# EAGLE design untitled2 (EAGLE 7.2.0)
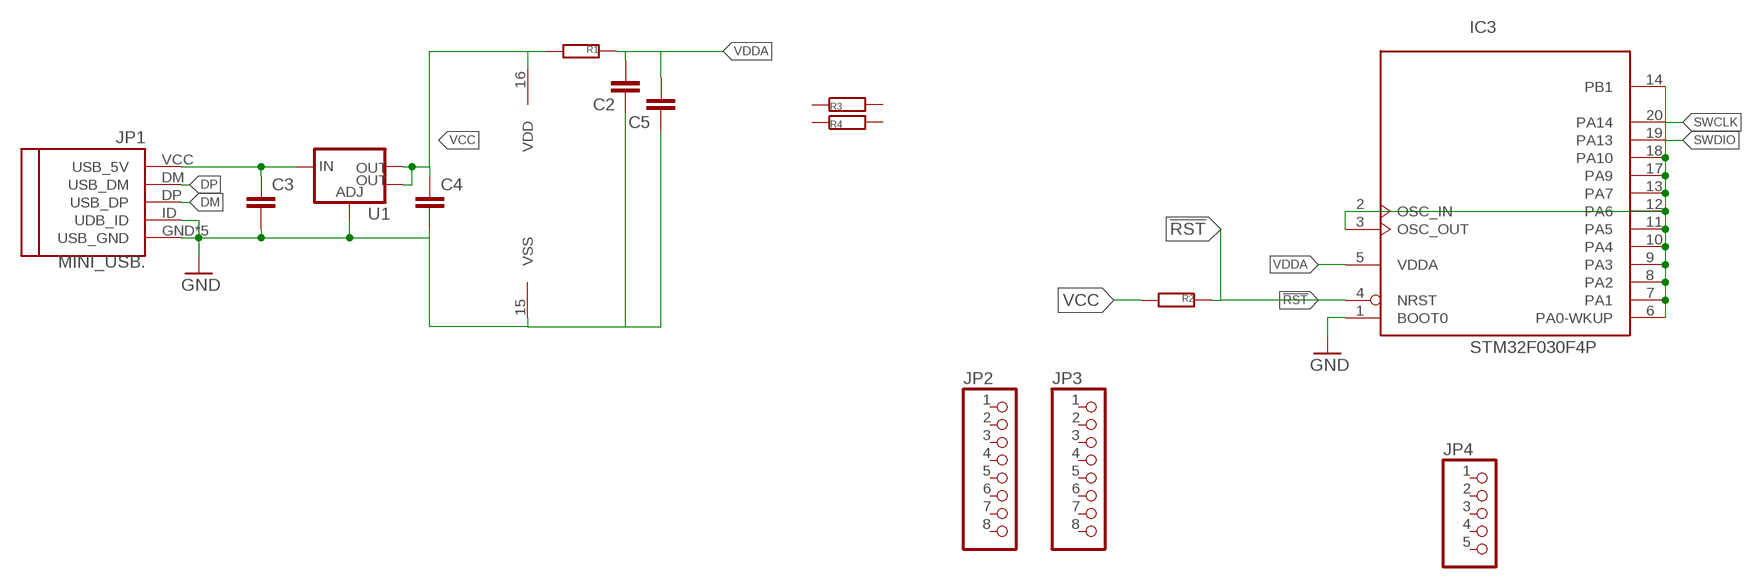
[diagram p0: schematic, sheet 1]

## Parts
C2  CC0805  [C0805]
C3  CC0805  [C0805]
C4  CC0805  [C0805]
C5  CC0805  [C0805]
IC3  STM32F030F4P  [TSSOP20-I]
JP1  MINI_USB.  [32005-201]
JP2  PINHD-1X08_2.54  [1X08]
JP3  PINHD-1X08_2.54  [1X08]
JP4  PINHD-1X05_2.54  [1X05]
R1  R0603  [0603]
R2  R0603  [0603]
R3  R0805  [R0805]
R4  R0805  [R0805]
U1  V_REG_LM1117SOT223  [SOT223]

## Nets
5V: C3.1 JP1.VCC(USB_5V) U1.3(IN)
!RST: IC3.4(NRST) R2.1
DM: JP1.DP(USB_DP)
DP: JP1.DM(USB_DM)
GND: C2.1 C3.2 C4.2 C5.1 IC3.1(BOOT0) IC3.15(VSS) JP1.GND(USB_GND) JP1.ID(UDB_ID) JP1.M1(USB_GND) JP1.M2(USB_GND) JP1.M3(USB_GND) JP1.M4(USB_GND) U1.1(ADJ)
N$4: IC3.2(OSC_IN) IC3.3(OSC_OUT) IC3.6(PA0-WKUP) IC3.7(PA1) IC3.8(PA2) IC3.9(PA3) IC3.10(PA4) IC3.11(PA5) IC3.12(PA6) IC3.13(PA7) IC3.14(PB1) IC3.17(PA9) IC3.18(PA10)
SWCLK: IC3.20(PA14)
SWDIO: IC3.19(PA13)
VCC: C4.1 IC3.16(VDD) R1.2 R2.2 U1.2(OUT) U1.4(OUT)
VDDA: C2.2 C5.2 IC3.5(VDDA) R1.1
Unconnected: JP2.1 JP2.2 JP2.3 JP2.4 JP2.5 JP2.6 JP2.7 JP2.8 JP3.1 JP3.2 JP3.3 JP3.4 JP3.5 JP3.6 JP3.7 JP3.8 JP4.1 JP4.2 JP4.3 JP4.4 JP4.5 R3.1 R3.2 R4.1 R4.2

## Library data of the parts
C2-C5 = CasaLibrary:C: Capacitor
IC3 = micro-stm_v3:STM32F030F*P: ARM 32-bit Cortex™-M0 CPU 48 MHz maximum frequency 16 Kbytes of Flash memory 4 kbytes of SRAM 15 GPIOs 2.4 to 3.6 V application supply
JP1 = connectors:MINI_USB
JP2 JP3 = pinhead-2:PINHD-1X08: PIN HEADER
JP4 = pinhead-2:PINHD-1X05: PIN HEADER
R1-R4 = CasaLibrary:R
U1 = CasaLibrary:V_REG_LM1117: Voltage Regulator LM1117 Standard adjustable voltage regulator but in SMD form. Spark Fun Electronics SKU : COM-00595; PROD_ID: VREG-08170

## Board
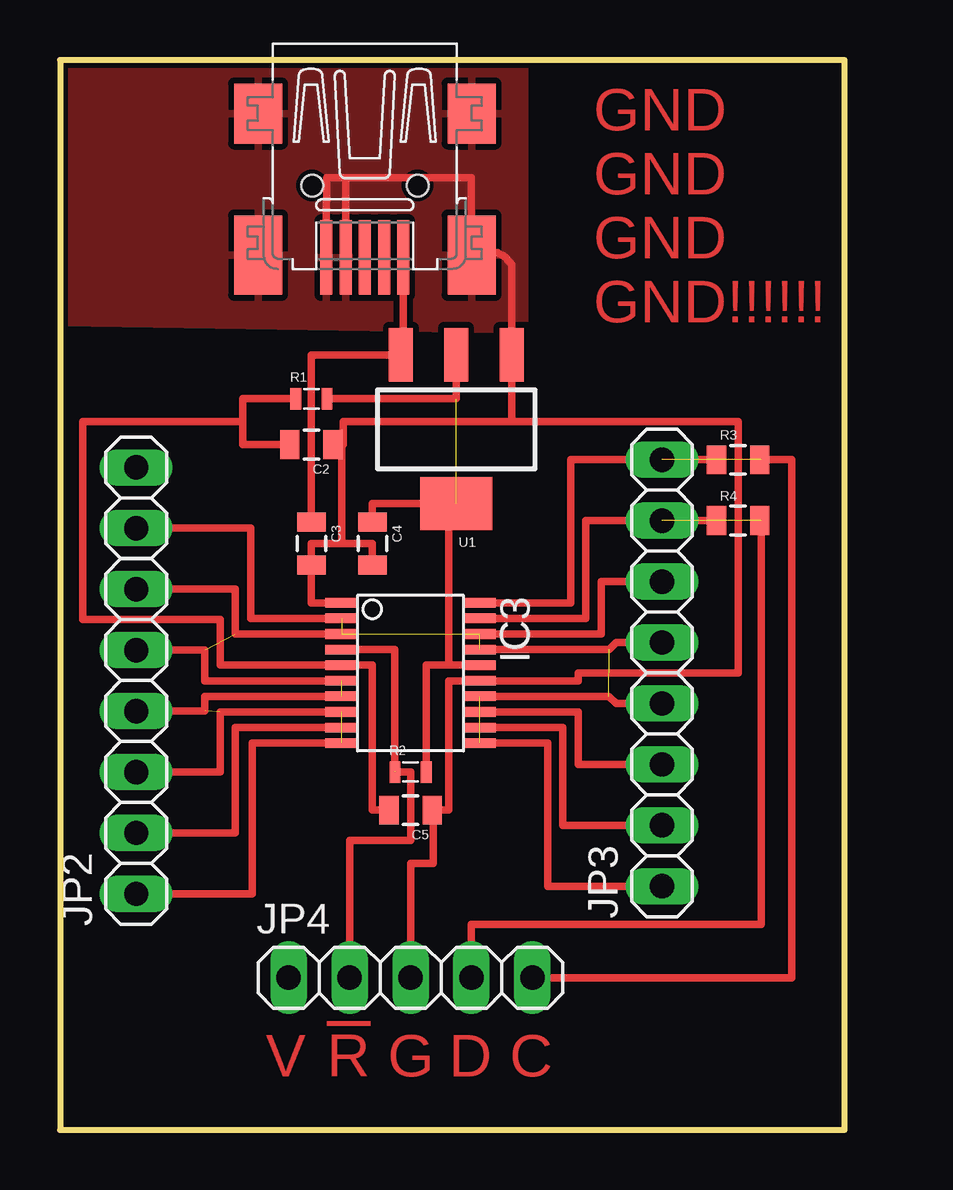
[diagram p1: board, top side]

Size 32.7 x 44.6 mm. Coordinates in mm from the lower left corner, seen from the top.
Outline: 0,0 32.7,0 32.7,44.6 0,44.6 0,0
Copper layers (1*16): Top 0.035mm / dielectric 1.5mm / Bottom 0.035mm
Design rules "default *": minimum track width 0.2mm, minimum drill 0.2mm, track to track 0.25mm, track to pad 0.25mm, pad to pad 0.25mm, via to via 0.25mm, smd to smd 0.2mm, copper to edge 0.2mm, drill to drill 0.2mm, minimum pad ring 10mil, minimum via ring 8mil, stop-mask expansion 4mil, vias tented up to drill 0mil, thermal gap 10mil

### Footprints (pad centres in the part's own frame; a part is rotated, then mirrored left to right if it is on the bottom)
C0805 = smd 0.8 x 1.2: 1 -0.9,0; 2 0.9,0
TSSOP20-I = smd 0.4 x 1.35: 1 -2.925,-2.875; 2 -2.275,-2.875; 3 -1.625,-2.875; 4 -0.975,-2.875; 5 -0.325,-2.875; 6 0.325,-2.875; 7 0.975,-2.875; 8 1.625,-2.875; 9 2.275,-2.875; 10 2.925,-2.875; 11 2.925,2.875; 12 2.275,2.875; 13 1.625,2.875; 14 0.975,2.875; 15 0.325,2.875; 16 -0.325,2.875; 17 -0.975,2.875; 18 -1.625,2.875; 19 -2.275,2.875; 20 -2.925,2.875
32005-201 = smd 3.1 x 0.5: DM 3,0.8; DP 3,0; GND 3,-1.6; ID 3,-0.8; VCC 3,1.6 | smd 2.5 x 2: M1 -3,-4.45; M2 -3,4.45 | smd 3.3 x 2: M3 2.9,4.45; M4 2.9,-4.45 | hole 0.9: 0,2.2; 0,-2.2
1X08 = drill 1.016 long: 1 -8.89,0; 2 -6.35,0; 3 -3.81,0; 4 -1.27,0; 5 1.27,0; 6 3.81,0; 7 6.35,0; 8 8.89,0
1X05 = drill 1.016 long: 1 -5.08,0; 2 -2.54,0; 3 0,0; 4 2.54,0; 5 5.08,0
0603 = smd 0.45 x 0.9: 1 -0.65,0; 2 0.65,0
R0805 = smd 0.8 x 1.2: 1 -0.9,0; 2 0.9,0
SOT223 = smd 1 x 2.235: 1 -2.311,-3.099; 2 0,-3.099; 3 2.311,-3.099 | smd 3 x 2.2: 4 0,3.099

### Placement (x,y rotation side)
C2  10.48,28.58 180 top
C3  10.48,24.45 270 top
C4  13.02,24.45 270 top
C5  14.61,13.34 180 top
IC3  14.61,19.05 270 top
JP1  12.7,39.37 270 top
JP2  3.17,18.73 90 top
JP3  25.08,19.05 90 top
JP4  14.61,6.35 0 top
R1  10.48,30.48 0 top
R2  14.61,14.92 0 top
R3  28.26,27.94 0 top
R4  28.26,25.4 0 top
U1  16.51,29.21 180 top

### Tracks (layer width: path | path; a pad name or v marks a point on that pad's centre or on a via)
5V
  Top 0.305: JP1.VCC 14.3,32.41 U1.3 10.48,32.31 C3.1
!RST  (1 unrouted)
  Top 0.305: IC3.4 13.96,20.02 R2.1 | 13.97,14.92 14.6,14.92 14.6,12.07 12.07,12.07 12.07,6.98
GND
  Top 0.305: 11.75,21.98 IC3.1 10.48,21.98 C3.2 | C5.1 16.19,13.34 16.19,18.73 IC3.15 21.59,18.73 21.59,19.05 28.26,19.05 28.26,29.53 18.82,29.53 | JP1.M3 arc-90 18.82,36.07 U1.1 18.82,29.53 | 18.82,29.53 11.8,29.53 11.8,28.58 11.75,28.58 | JP1.GND 11.1,38.73 11.11,38.73 11.11,39.69 11.9,39.69 | 11.9,39.69 17.14,39.69 17.14,36.51 | JP1.ID 11.9,39.69 | C2.1 11.75,28.58 | 10.48,23.5 C3.2 | 11.75,28.58 11.75,24.45 | 11.75,24.45 10.48,24.45 C3.2 | 11.75,24.45 13.02,24.45 C4.2
  pour Top: 0,44.77 19.37,44.45 19.37,33.34 0,33.66
N$2
  Top 0.305: 15.56,13.02 15.56,11.11 14.6,11.11 14.6,6.98
N$3
  Top 0.305: 27.31,27.94 26.03,27.94
N$4  (12 unrouted)
  Top 0.305: IC3.18 22.54,20.68 22.54,22.86 24.76,22.86 | IC3.17 22.88,20.02 23.18,20.32 25.08,20.32 | IC3.14 22.86,18.07 23.18,17.78 25.08,17.78 | IC3.13 21.59,17.43 21.59,15.24 25.08,15.24 | IC3.12 20.96,16.77 20.96,12.7 25.08,12.7 | IC3.11 20.32,16.12 20.32,10.16 25.08,10.16 | IC3.6 6.03,18.73 6.03,20 3.18,20 | IC3.7 6.03,18.07 6.03,17.46 3.18,17.46 | IC3.8 6.67,17.43 6.67,14.92 3.18,14.92 | IC3.9 7.3,16.77 7.3,12.38 3.18,12.38 | IC3.10 8.01,16.12 8.01,9.84 3.18,9.84 | IC3.3 7.3,20.68 7.3,22.54 3.18,22.54 | IC3.2 7.94,21.32 7.94,25.08 3.18,25.08 3.18,24.77
N$5
  Top 0.305: 26.35,25.4 27.31,25.4
SWCLK  (1 unrouted)
  Top 0.305: IC3.20 21.27,21.98 21.27,27.94 25.08,27.94 | 29.21,27.94 30.48,27.94 30.48,6.35 20.32,6.35
SWDIO  (1 unrouted)
  Top 0.305: IC3.19 21.91,21.32 21.91,25.4 25.08,25.4 | 29.21,25.4 29.21,8.57 17.14,8.57 17.14,6.98
VCC  (1 unrouted)
  Top 0.305: IC3.16 16.19,19.38 | R2.2 15.25,19.38 16.19,19.38 | 16.19,19.38 16.19,25.79 | 16.19,25.79 arc-90 U1.4 13.02,26.11 C4.1 | 16.19,25.79 arc-90 15.8,25.4 | U1.2 16.51,30.48 R1.2 11.11,30.48
VDDA
  Top 0.305: C5.2 13.02,13.34 13.02,19.38 IC3.5 6.67,19.38 6.67,21.27 0.95,21.27 0.95,29.53 7.62,29.53 | R1.1 7.62,30.48 7.62,29.53 | C2.2 7.62,28.58 7.62,29.53

### Text on the board
Top: GND / GND / GND / GND!!!!!! | V | !R | G | D | C